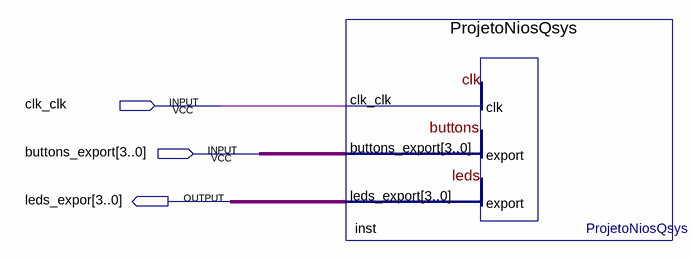
[diagram p0: schematic sheet]
// Quartus schematic ProjetoProcessadorQuartus.bdf as structural Verilog: 1 symbols, 3 pins
module ProjetoProcessadorQuartus (
  input  clk_clk,
  input  [3:0] buttons_export,
  output [3:0] leds_expor
);

  ProjetoNiosQsys inst (.clk_clk(clk_clk), .buttons_export(buttons_export), .leds_export(leds_expor));
endmodule
